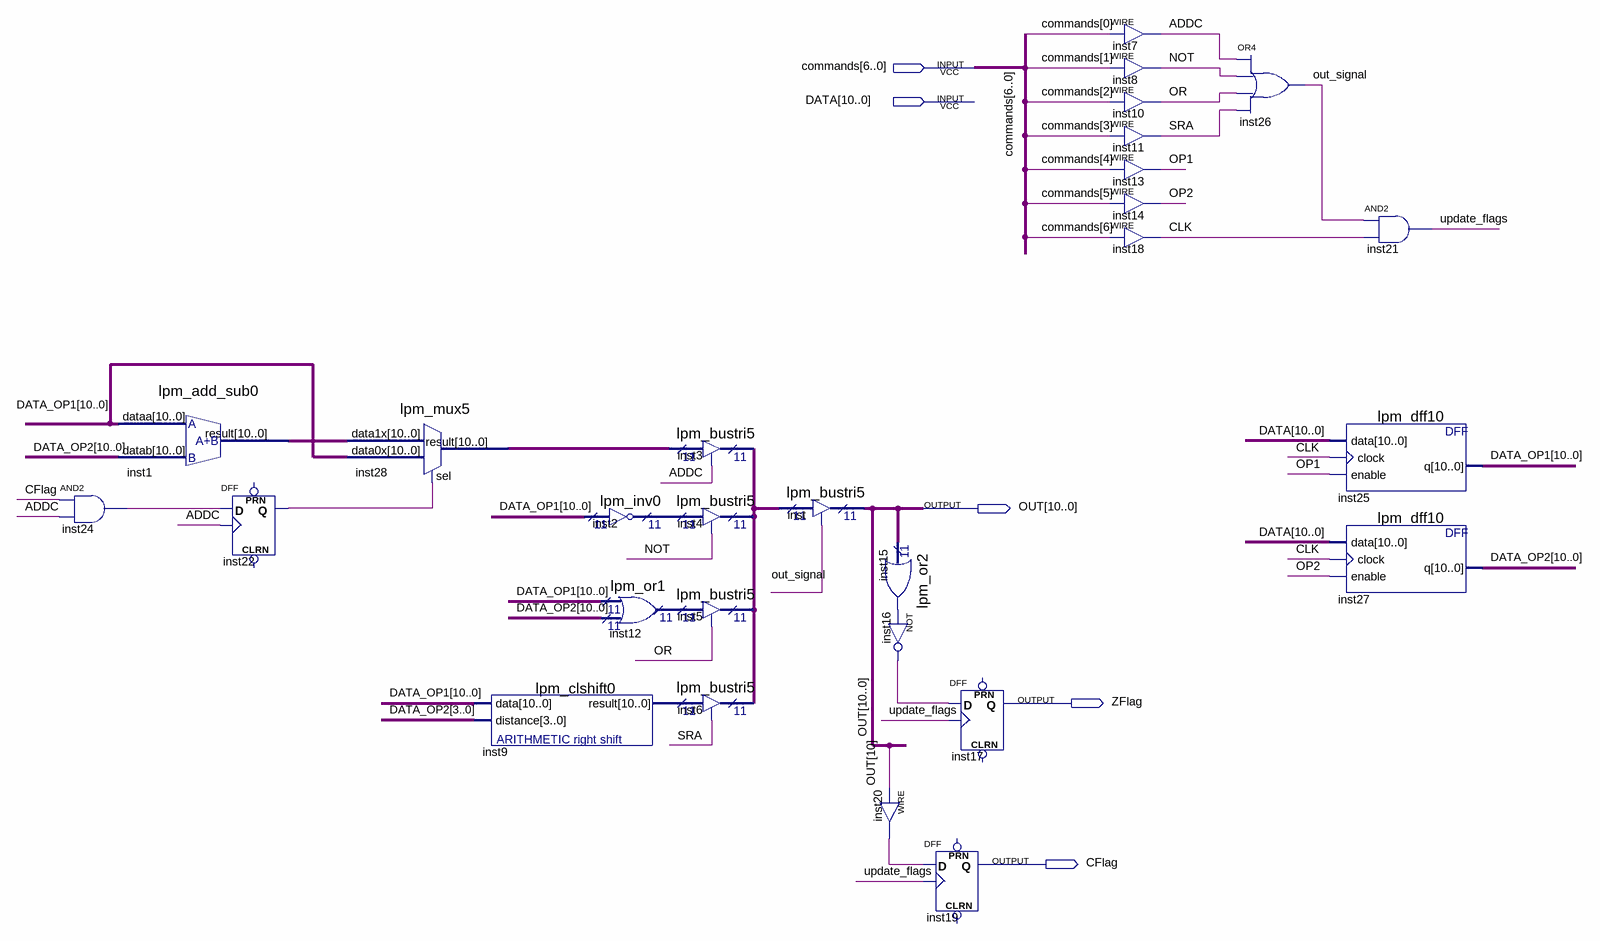
[diagram p0: schematic sheet]
// Quartus schematic ALU.bdf as structural Verilog: 28 symbols, 5 pins
module ALU (
  input  [6:0] commands,
  input  [10:0] DATA,
  output [10:0] OUT,
  output ZFlag,
  output CFlag
);

  wire ADDC, CLK, inst15_result, inst16_out, inst20_out, inst22_q, inst24_out, NOT, OP1, OP2, OR, out_signal,
       SRA, update_flags;
  wire [10:0] DATA_OP1, DATA_OP2, inst1_result, inst2_result, inst3_tridata, inst9_result, inst12_result,
       inst28_result;

  and inst24 (inst24_out, CFlag, ADDC);
  lpm_add_sub0 inst1 (.dataa(DATA_OP1), .datab(DATA_OP2), .result(inst1_result));
  DFF inst22 (.CLK(ADDC), .D(inst24_out), .Q(inst22_q));  // open: CLRN, PRN
  lpm_mux5 inst28 (.data1x(inst1_result), .data0x(DATA_OP1), .sel(inst22_q), .result(inst28_result));
  lpm_clshift0 inst9 (.data(DATA_OP1), .distance(DATA_OP2[3:0]), .result(inst9_result));
  lpm_inv0 inst2 (.data(DATA_OP1), .result(inst2_result));
  lpm_or1 inst12 (.data0x(DATA_OP1), .data1x(DATA_OP2), .result(inst12_result));
  lpm_bustri5 inst3 (.enabledt(ADDC), .data(inst28_result), .tridata(inst3_tridata));
  lpm_bustri5 inst4 (.enabledt(NOT), .data(inst2_result), .tridata(inst3_tridata));
  lpm_bustri5 inst5 (.enabledt(OR), .data(inst12_result), .tridata(inst3_tridata));
  lpm_bustri5 inst6 (.enabledt(SRA), .data(inst9_result), .tridata(inst3_tridata));
  lpm_bustri5 inst (.enabledt(out_signal), .data(inst3_tridata), .tridata(OUT));
  lpm_or2 inst15 (.data(OUT), .result(inst15_result));
  not inst16 (inst16_out, inst15_result);
  assign inst20_out = OUT[10];  // WIRE inst20
  DFF inst19 (.CLK(update_flags), .D(inst20_out), .Q(CFlag));  // open: CLRN, PRN
  DFF inst17 (.CLK(update_flags), .D(inst16_out), .Q(ZFlag));  // open: CLRN, PRN
  assign ADDC = commands[0];  // WIRE inst7
  assign NOT = commands[1];  // WIRE inst8
  assign OR = commands[2];  // WIRE inst10
  assign SRA = commands[3];  // WIRE inst11
  assign OP1 = commands[4];  // WIRE inst13
  assign OP2 = commands[5];  // WIRE inst14
  assign CLK = commands[6];  // WIRE inst18
  or inst26 (out_signal, ADDC, NOT, OR, SRA);
  lpm_dff10 inst25 (.data(DATA), .clock(CLK), .enable(OP1), .q(DATA_OP1));
  lpm_dff10 inst27 (.data(DATA), .clock(CLK), .enable(OP2), .q(DATA_OP2));
  and inst21 (update_flags, out_signal, CLK);
endmodule
